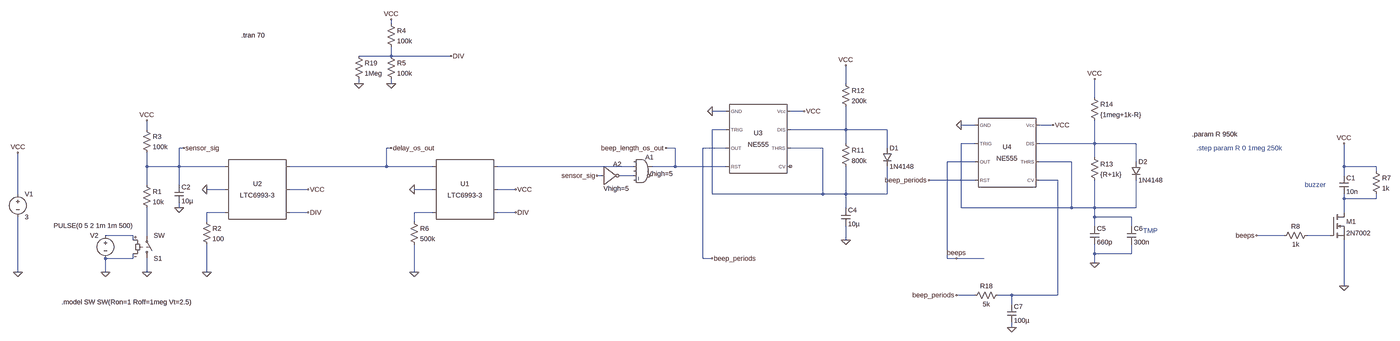
[diagram p0: schematic close_the_door_OS.asc, whole sheet]
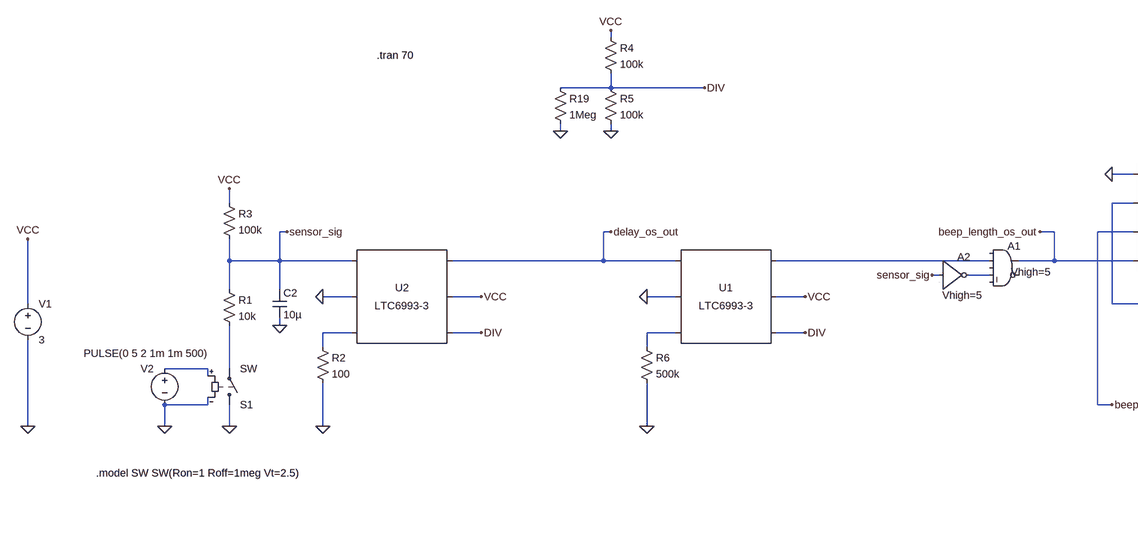
[diagram p1: schematic close_the_door_OS.asc, part, row 1 of 1, column 1 of 2]
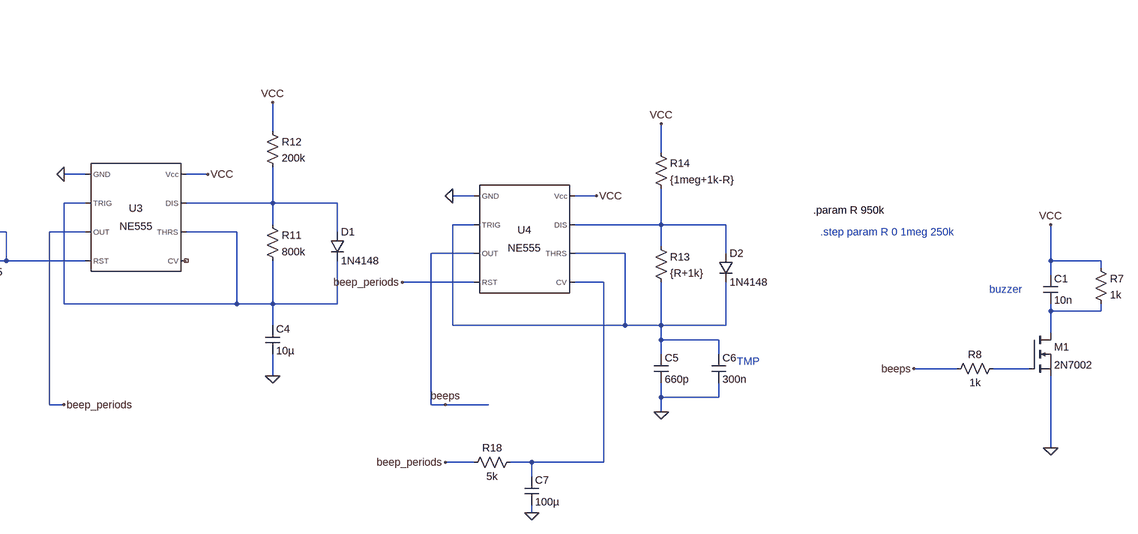
[diagram p2: schematic close_the_door_OS.asc, part, row 1 of 1, column 2 of 2]
close_the_door_OS.asc, the LTspice schematic file:
Version 4
SHEET 1 4504 924
WIRE 960 -256 960 -272
WIRE 960 -144 960 -176
WIRE 960 -144 848 -144
WIRE 1168 -144 960 -144
WIRE 848 -48 848 -64
WIRE 960 -48 960 -64
WIRE 2560 -48 2560 -112
WIRE 3424 0 3424 -64
WIRE 2144 48 2096 48
WIRE 2416 48 2368 48
WIRE 3008 96 2960 96
WIRE 3280 96 3232 96
WIRE 80 112 80 80
WIRE 2144 112 2096 112
WIRE 2560 112 2560 32
WIRE 2560 112 2368 112
WIRE 2704 112 2560 112
WIRE 2560 160 2560 112
WIRE 3008 160 2960 160
WIRE 3424 160 3424 80
WIRE 3424 160 3232 160
WIRE 3568 160 3424 160
WIRE 208 176 192 176
WIRE 960 176 944 176
WIRE 1968 176 1936 176
WIRE 2144 176 2064 176
WIRE 2480 176 2368 176
WIRE 2704 176 2704 112
WIRE 3424 208 3424 160
WIRE 3008 224 2912 224
WIRE 3344 224 3232 224
WIRE 3568 224 3568 160
WIRE 80 240 80 192
WIRE 192 240 192 176
WIRE 192 240 80 240
WIRE 352 240 192 240
WIRE 944 240 944 176
WIRE 944 240 576 240
WIRE 1104 240 944 240
WIRE 1824 240 1328 240
WIRE 1968 240 1968 176
WIRE 1968 240 1888 240
WIRE 2144 240 1968 240
WIRE 4320 240 4320 160
WIRE 4432 240 4320 240
WIRE 4432 256 4432 240
WIRE 1712 272 1696 272
WIRE 1824 272 1776 272
WIRE 4320 272 4320 240
WIRE 3008 288 2848 288
WIRE 3296 288 3232 288
WIRE 80 304 80 240
WIRE 192 304 192 240
WIRE 352 320 288 320
WIRE 640 320 576 320
WIRE 1104 320 1040 320
WIRE 1392 320 1328 320
WIRE -368 336 -368 192
WIRE 2096 336 2096 112
WIRE 2480 336 2480 176
WIRE 2480 336 2096 336
WIRE 2560 336 2560 240
WIRE 2560 336 2480 336
WIRE 2704 336 2704 240
WIRE 2704 336 2560 336
WIRE 4320 352 4320 336
WIRE 4432 352 4432 336
WIRE 4432 352 4320 352
WIRE 192 384 192 368
WIRE 2560 384 2560 336
WIRE 2960 384 2960 160
WIRE 3344 384 3344 224
WIRE 3344 384 2960 384
WIRE 3424 384 3424 288
WIRE 3424 384 3344 384
WIRE 3568 384 3568 288
WIRE 3568 384 3424 384
WIRE 352 400 288 400
WIRE 640 400 576 400
WIRE 1104 400 1040 400
WIRE 1392 400 1328 400
WIRE 4320 400 4320 352
WIRE 3424 416 3424 384
WIRE 3552 416 3424 416
WIRE 288 432 288 400
WIRE 1040 432 1040 400
WIRE 3424 448 3424 416
WIRE 3552 448 3552 416
WIRE 32 480 -64 480
WIRE 80 480 80 384
WIRE 4112 480 4016 480
WIRE 4272 480 4192 480
WIRE 32 496 32 480
WIRE 2560 496 2560 448
WIRE 3424 544 3424 512
WIRE 3552 544 3552 512
WIRE 3552 544 3424 544
WIRE 32 560 32 544
WIRE 32 560 -64 560
WIRE 2064 560 2064 176
WIRE 2096 560 2064 560
WIRE 2912 560 2912 224
WIRE 2944 560 2912 560
WIRE 3040 560 2944 560
WIRE 3424 576 3424 544
WIRE -368 608 -368 416
WIRE -64 608 -64 560
WIRE 80 608 80 560
WIRE 288 608 288 512
WIRE 1040 608 1040 512
WIRE 4320 656 4320 496
WIRE 3008 688 2944 688
WIRE 3136 688 3088 688
WIRE 3296 688 3296 288
WIRE 3296 688 3136 688
WIRE 3136 720 3136 688
WIRE 3136 800 3136 784
FLAG -368 608 0
FLAG -64 608 0
FLAG -368 192 VCC
FLAG 80 608 0
FLAG 640 320 VCC
FLAG 288 608 0
FLAG 192 384 0
FLAG 80 80 VCC
FLAG 960 -272 VCC
FLAG 960 -48 0
FLAG 288 320 0
FLAG 1392 320 VCC
FLAG 1040 608 0
FLAG 1040 320 0
FLAG 208 176 sensor_sig
FLAG 960 176 delay_os_out
FLAG 1936 176 beep_length_os_out
FLAG 2096 48 0
FLAG 2416 48 VCC
FLAG 2560 -112 VCC
FLAG 2560 496 0
FLAG 2960 96 0
FLAG 3280 96 VCC
FLAG 3424 -64 VCC
FLAG 3424 576 0
FLAG 2096 560 beep_periods
FLAG 2944 560 beeps
FLAG 2848 288 beep_periods
FLAG 1696 272 sensor_sig
FLAG 4016 480 beeps
FLAG 4320 656 0
FLAG 4320 160 VCC
FLAG 3136 800 0
FLAG 2944 688 beep_periods
FLAG 848 -48 0
FLAG 1168 -144 DIV
FLAG 640 400 DIV
FLAG 1392 400 DIV
SYMBOL voltage -368 320 R0
WINDOW 123 0 0 Left 0
WINDOW 39 0 0 Left 0
SYMATTR InstName V1
SYMATTR Value 3
SYMBOL voltage -64 464 M0
WINDOW 123 0 0 Left 0
WINDOW 39 0 0 Left 0
WINDOW 3 -97 -18 Left 2
SYMATTR Value PULSE(0 5 2 1m 1m 500)
SYMATTR InstName V2
SYMBOL sw 80 576 M180
SYMATTR InstName S1
SYMBOL res 64 288 R0
SYMATTR InstName R1
SYMATTR Value 10k
SYMBOL res 272 416 R0
SYMATTR InstName R2
SYMATTR Value 100
SYMBOL SpecialFunctions\\LTC6993-3 464 320 R0
SYMATTR InstName U2
SYMBOL res 64 96 R0
SYMATTR InstName R3
SYMATTR Value 100k
SYMBOL cap 176 304 R0
SYMATTR InstName C2
SYMATTR Value 10µ
SYMBOL res 944 -272 R0
SYMATTR InstName R4
SYMATTR Value 100k
SYMBOL res 944 -160 R0
SYMATTR InstName R5
SYMATTR Value 100k
SYMBOL res 1024 416 R0
SYMATTR InstName R6
SYMATTR Value 500k
SYMBOL SpecialFunctions\\LTC6993-3 1216 320 R0
SYMATTR InstName U1
SYMBOL Misc\\NE555 2256 144 R0
SYMATTR InstName U3
SYMBOL res 2544 144 R0
SYMATTR InstName R11
SYMATTR Value 800k
SYMBOL cap 2544 384 R0
SYMATTR InstName C4
SYMATTR Value 10µ
SYMBOL res 2544 -64 R0
SYMATTR InstName R12
SYMATTR Value 200k
SYMBOL diode 2688 176 R0
SYMATTR InstName D1
SYMATTR Value 1N4148
SYMBOL Misc\\NE555 3120 192 R0
SYMATTR InstName U4
SYMBOL res 3408 192 R0
SYMATTR InstName R13
SYMATTR Value {R+1k}
SYMBOL cap 3408 448 R0
SYMATTR InstName C5
SYMATTR Value 660p
SYMBOL res 3408 -16 R0
SYMATTR InstName R14
SYMATTR Value {1meg+1k-R}
SYMBOL diode 3552 224 R0
SYMATTR InstName D2
SYMATTR Value 1N4148
SYMBOL Digital\\and 1856 192 R0
WINDOW 3 15 73 Left 2
SYMATTR Value Vhigh=5
SYMATTR InstName A1
SYMBOL Digital\\inv 1712 208 R0
WINDOW 3 7 109 Left 2
SYMATTR Value Vhigh=5
SYMATTR InstName A2
SYMBOL nmos 4272 400 R0
SYMATTR InstName M1
SYMATTR Value 2N7002
SYMBOL res 3104 672 R90
WINDOW 0 0 56 VBottom 2
WINDOW 3 32 56 VTop 2
SYMATTR InstName R18
SYMATTR Value 5k
SYMBOL cap 3120 720 R0
SYMATTR InstName C7
SYMATTR Value 100µ
SYMBOL cap 3536 448 R0
SYMATTR InstName C6
SYMATTR Value 300n
SYMBOL res 832 -160 R0
SYMATTR InstName R19
SYMATTR Value 1Meg
SYMBOL cap 4304 272 R0
SYMATTR InstName C1
SYMATTR Value 10n
SYMBOL res 4416 240 R0
SYMATTR InstName R7
SYMATTR Value 1k
SYMBOL res 4208 464 R90
WINDOW 0 0 56 VBottom 2
WINDOW 3 32 56 VTop 2
SYMATTR InstName R8
SYMATTR Value 1k
TEXT 408 -216 Left 2 !.tran 70
TEXT -216 712 Left 2 !.model SW SW(Ron=1 Roff=1meg Vt=2.5)
TEXT 3592 464 Left 2 ;TMP
TEXT 4184 304 Left 2 ;buzzer
TEXT 3792 128 Left 2 !.param R 950k
TEXT 3808 176 Left 2 ;.step param R 0 1meg 250k

The netlist it stands for:
* close_the_door_OS.asc
V1 VCC 0 3
V2 N011 0 PULSE(0 5 2 1m 1m 500)
S1 0 N012 N011 0 SW
R1 sensor_sig N012 10k
R2 N009 0 100
XU2 sensor_sig 0 N009 DIV VCC delay_os_out LTC6993-3
R3 VCC sensor_sig 100k
C2 sensor_sig 0 10µ
R4 VCC DIV 100k
R5 DIV 0 100k
R6 N010 0 500k
XU1 delay_os_out 0 N010 DIV VCC N005 LTC6993-3
XU3 0 N001 beep_periods beep_length_os_out NC_01 N001 N002 VCC NE555  ; pins GND TRIG OUT RST CV THRS DIS Vcc
R11 N002 N001 800k
C4 N001 0 10µ
R12 VCC N002 200k
D1 N002 N001 1N4148
XU4 0 N003 beeps beep_periods N007 N003 N004 VCC NE555  ; pins GND TRIG OUT RST CV THRS DIS Vcc
R13 N004 N003 {R+1k}
C5 N003 0 660p
R14 VCC N004 {1meg+1k-R}
D2 N004 N003 1N4148
A1 0 N005 0 N006 0 0 beep_length_os_out 0 AND Vhigh=5
A2 sensor_sig 0 0 0 0 N006 0 0 BUF Vhigh=5
M1 N008 N013 0 0 2N7002
R18 N007 beep_periods 5k
C7 N007 0 100µ
C6 N003 0 300n
R19 DIV 0 1Meg
C1 VCC N008 10n
R7 VCC N008 1k
R8 N013 beeps 1k
.model D D
.lib standard.dio
.model NMOS NMOS
.model PMOS PMOS
.lib standard.mos
.tran 70
.model SW SW(Ron=1 Roff=1meg Vt=2.5)
* TMP
* buzzer
.param R 950k
* .step param R 0 1meg 250k
.lib LTC6993-3.sub
.lib NE555.sub
.backanno
.end